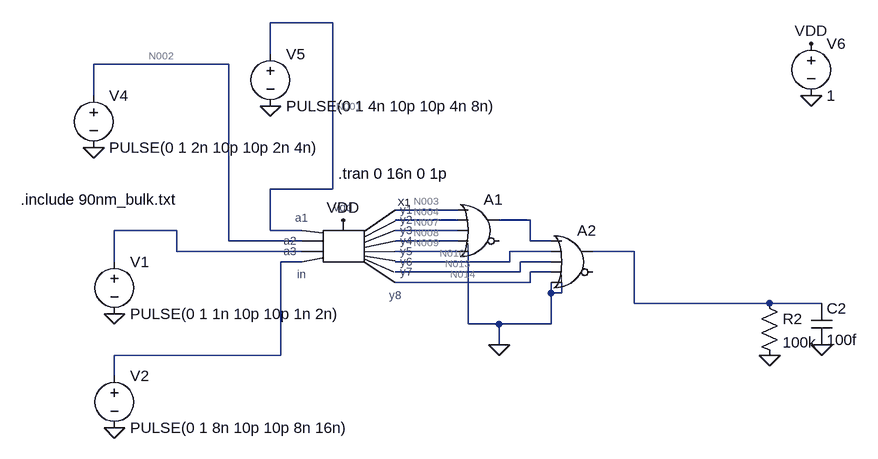
[diagram p0: schematic 2_exp1.asc]
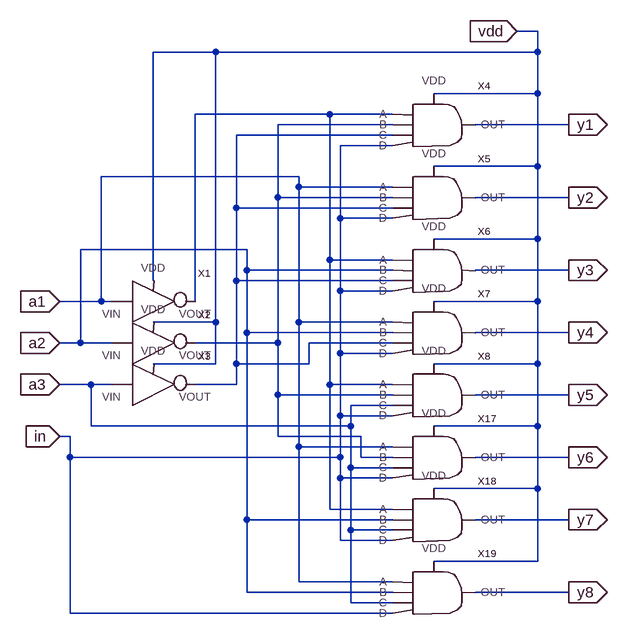
[diagram p1: sub-circuit decoder.asc]
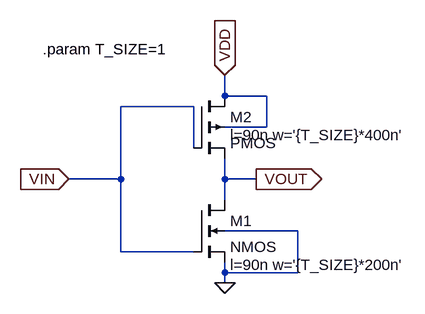
[diagram p2: sub-circuit inverter.asc]
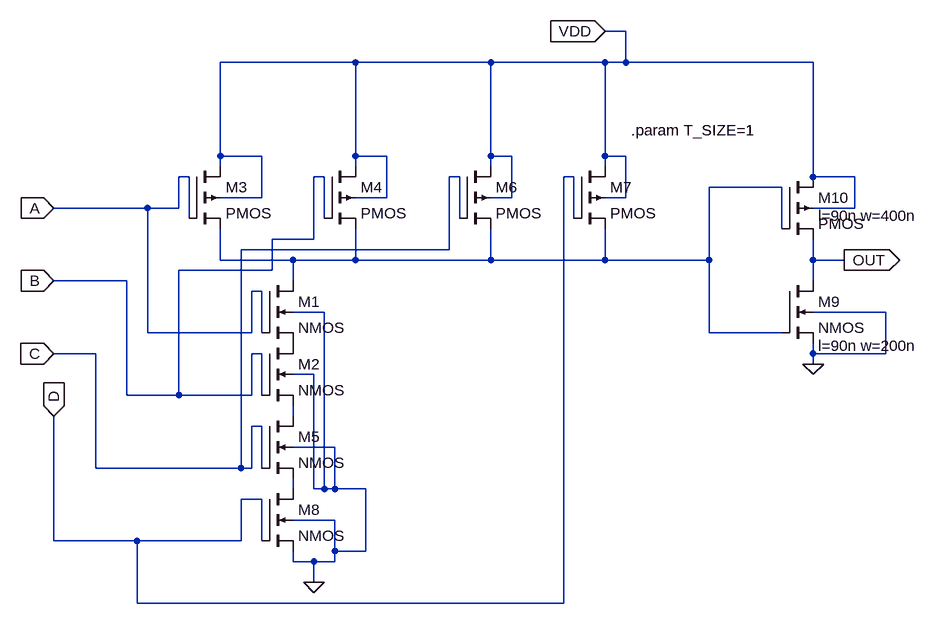
[diagram p3: sub-circuit and4.asc]
2_exp1.asc, the LTspice schematic file:
Version 4
SHEET 1 972 680
WIRE 160 -288 64 -288
WIRE 64 -240 64 -288
WIRE 0 -224 -208 -224
WIRE -208 -176 -208 -224
WIRE 160 -32 160 -288
WIRE 160 -32 64 -32
WIRE 352 0 256 0
WIRE 352 16 256 16
WIRE 464 16 416 16
WIRE -80 32 -176 32
WIRE 64 32 64 -32
WIRE 112 32 64 32
WIRE 352 32 256 32
WIRE 0 48 0 -224
WIRE 112 48 0 48
WIRE 352 48 256 48
WIRE 464 48 464 16
WIRE 496 48 464 48
WIRE -80 64 -80 32
WIRE 112 64 -80 64
WIRE 352 64 256 64
WIRE 496 64 432 64
WIRE 624 64 560 64
WIRE -176 80 -176 32
WIRE 112 80 80 80
WIRE 432 80 432 64
WIRE 432 80 256 80
WIRE 496 80 448 80
WIRE 448 96 448 80
WIRE 448 96 256 96
WIRE 496 96 464 96
WIRE 464 112 464 96
WIRE 464 112 256 112
WIRE 496 128 496 112
WIRE 512 128 512 112
WIRE 512 128 496 128
WIRE 624 144 624 64
WIRE 832 144 624 144
WIRE 912 144 832 144
WIRE 368 176 368 64
WIRE 416 176 368 176
WIRE 496 176 496 128
WIRE 496 176 416 176
WIRE 416 208 416 176
WIRE 80 224 80 80
WIRE 80 224 -176 224
WIRE -176 256 -176 224
FLAG -176 336 0
FLAG -176 160 0
FLAG -208 -96 0
FLAG 64 -160 0
FLAG 896 -176 0
FLAG 896 -256 VDD
FLAG 832 224 0
FLAG 912 208 0
FLAG 416 208 0
FLAG 176 16 VDD
SYMBOL voltage -176 64 R0
WINDOW 123 0 0 Left 2
WINDOW 39 0 0 Left 2
SYMATTR InstName V1
SYMATTR Value PULSE(0 1 1n 10p 10p 1n 2n)
SYMBOL voltage -176 240 R0
WINDOW 123 0 0 Left 2
WINDOW 39 0 0 Left 2
SYMATTR InstName V2
SYMATTR Value PULSE(0 1 8n 10p 10p 8n 16n)
SYMBOL decoder 176 64 R0
SYMATTR InstName X1
SYMBOL voltage -208 -192 R0
WINDOW 123 0 0 Left 2
WINDOW 39 0 0 Left 2
SYMATTR InstName V4
SYMATTR Value PULSE(0 1 2n 10p 10p 2n 4n)
SYMBOL voltage 64 -256 R0
WINDOW 123 0 0 Left 2
WINDOW 39 0 0 Left 2
SYMATTR InstName V5
SYMATTR Value PULSE(0 1 4n 10p 10p 4n 8n)
SYMBOL voltage 896 -272 R0
WINDOW 123 0 0 Left 2
WINDOW 39 0 0 Left 2
SYMATTR InstName V6
SYMATTR Value 1
SYMBOL res 816 128 R0
SYMATTR InstName R2
SYMATTR Value 100k
SYMBOL cap 896 144 R0
SYMATTR InstName C2
SYMATTR Value 100f
SYMBOL Digital\\or 384 -32 R0
SYMATTR InstName A1
SYMBOL Digital\\or 528 16 R0
SYMATTR InstName A2
TEXT -320 -16 Left 2 !.include 90nm_bulk.txt
TEXT 168 -56 Left 2 !.tran 0 16n 0 1p

decoder.asc, the sub-circuit schematic file:
Version 4
SHEET 1 1524 680
WIRE 736 -384 704 -384
WIRE 240 -352 144 -352
WIRE 736 -352 736 -384
WIRE 736 -352 240 -352
WIRE 736 -288 736 -352
WIRE 736 -288 576 -288
WIRE 416 -256 208 -256
WIRE 512 -256 416 -256
WIRE 512 -240 336 -240
WIRE 784 -240 640 -240
WIRE 512 -224 272 -224
WIRE 512 -208 432 -208
WIRE 736 -176 736 -288
WIRE 736 -176 576 -176
WIRE 368 -160 64 -160
WIRE 368 -144 368 -160
WIRE 512 -144 368 -144
WIRE 336 -128 336 -240
WIRE 512 -128 336 -128
WIRE 784 -128 640 -128
WIRE 272 -112 272 -224
WIRE 512 -112 272 -112
WIRE 432 -96 432 -208
WIRE 512 -96 432 -96
WIRE 736 -64 736 -176
WIRE 736 -64 576 -64
WIRE 288 -48 32 -48
WIRE 416 -32 416 -256
WIRE 512 -32 416 -32
WIRE 288 -16 288 -48
WIRE 512 -16 288 -16
WIRE 784 -16 640 -16
WIRE 144 0 144 -352
WIRE 272 0 272 -112
WIRE 512 0 272 0
WIRE 432 16 432 -96
WIRE 512 16 432 16
WIRE 64 32 64 -160
WIRE 64 32 0 32
WIRE 80 32 64 32
WIRE 208 32 208 -256
WIRE 736 32 736 -64
WIRE 736 32 576 32
WIRE 240 64 240 -352
WIRE 240 64 144 64
WIRE 368 64 368 -144
WIRE 512 64 368 64
WIRE 288 80 288 -16
WIRE 512 80 288 80
WIRE 784 80 640 80
WIRE 32 96 32 -48
WIRE 32 96 0 96
WIRE 80 96 32 96
WIRE 336 96 336 -128
WIRE 336 96 208 96
WIRE 512 96 384 96
WIRE 432 112 432 16
WIRE 512 112 432 112
WIRE 240 128 240 64
WIRE 240 128 144 128
WIRE 272 128 272 0
WIRE 384 128 384 96
WIRE 384 128 272 128
WIRE 736 128 736 32
WIRE 736 128 576 128
WIRE 48 160 0 160
WIRE 80 160 48 160
WIRE 272 160 272 128
WIRE 272 160 208 160
WIRE 416 160 416 -32
WIRE 512 160 416 160
WIRE 336 176 336 96
WIRE 512 176 336 176
WIRE 784 176 640 176
WIRE 512 192 448 192
WIRE 432 208 432 112
WIRE 512 208 432 208
WIRE 48 224 48 160
WIRE 448 224 448 192
WIRE 448 224 48 224
WIRE 736 224 736 128
WIRE 736 224 576 224
WIRE 16 240 0 240
WIRE 336 240 336 176
WIRE 464 240 336 240
WIRE 368 256 368 64
WIRE 512 256 368 256
WIRE 16 272 16 240
WIRE 432 272 432 208
WIRE 432 272 16 272
WIRE 464 272 464 240
WIRE 512 272 464 272
WIRE 784 272 640 272
WIRE 448 288 448 224
WIRE 512 288 448 288
WIRE 432 304 432 272
WIRE 512 304 432 304
WIRE 736 320 736 224
WIRE 736 320 576 320
WIRE 416 352 416 160
WIRE 512 352 416 352
WIRE 288 368 288 80
WIRE 512 368 288 368
WIRE 784 368 640 368
WIRE 448 384 448 288
WIRE 512 384 448 384
WIRE 432 400 432 304
WIRE 512 400 432 400
WIRE 736 432 736 320
WIRE 736 432 576 432
WIRE 368 464 368 256
WIRE 512 464 368 464
WIRE 288 480 288 368
WIRE 512 480 288 480
WIRE 784 480 640 480
WIRE 448 496 448 384
WIRE 512 496 448 496
WIRE 16 512 16 272
WIRE 512 512 16 512
FLAG 0 32 a1
IOPIN 0 32 In
FLAG 0 96 a2
IOPIN 0 96 In
FLAG 0 160 a3
IOPIN 0 160 In
FLAG 0 240 in
IOPIN 0 240 In
FLAG 704 -384 vdd
IOPIN 704 -384 In
FLAG 784 -240 y1
IOPIN 784 -240 Out
FLAG 784 -128 y2
IOPIN 784 -128 Out
FLAG 784 -16 y3
IOPIN 784 -16 Out
FLAG 784 80 y4
IOPIN 784 80 Out
FLAG 784 176 y5
IOPIN 784 176 Out
FLAG 784 272 y6
IOPIN 784 272 Out
FLAG 784 368 y7
IOPIN 784 368 Out
FLAG 784 480 y8
IOPIN 784 480 Out
SYMBOL inverter 144 32 R0
SYMATTR InstName X1
SYMBOL inverter 144 96 R0
SYMATTR InstName X2
SYMBOL inverter 144 160 R0
SYMATTR InstName X3
SYMBOL and4 592 -224 R0
SYMATTR InstName X4
SYMBOL and4 592 -112 R0
SYMATTR InstName X5
SYMBOL and4 592 0 R0
SYMATTR InstName X6
SYMBOL and4 592 96 R0
SYMATTR InstName X7
SYMBOL and4 592 192 R0
SYMATTR InstName X8
SYMBOL and4 592 288 R0
SYMATTR InstName X17
SYMBOL and4 592 384 R0
SYMATTR InstName X18
SYMBOL and4 592 496 R0
SYMATTR InstName X19

inverter.asc, the sub-circuit schematic file:
Version 4
SHEET 1 880 680
WIRE 176 -128 176 -160
WIRE 240 -128 176 -128
WIRE 128 -112 16 -112
WIRE 240 -80 240 -128
WIRE 240 -80 176 -80
WIRE 128 -48 128 -112
WIRE 16 0 16 -112
WIRE 16 0 -64 0
WIRE 176 0 176 -32
WIRE 224 0 176 0
WIRE 176 32 176 0
WIRE 288 80 176 80
WIRE 16 112 16 0
WIRE 128 112 16 112
WIRE 176 144 176 128
WIRE 288 144 288 80
WIRE 288 144 176 144
WIRE 176 160 176 144
FLAG 176 160 0
FLAG -64 0 VIN
IOPIN -64 0 In
FLAG 224 0 VOUT
IOPIN 224 0 Out
FLAG 176 -160 VDD
IOPIN 176 -160 In
SYMBOL nmos4 128 32 R0
WINDOW 123 56 100 Left 2
SYMATTR InstName M1
SYMATTR Value2 l=90n w='{T_SIZE}*200n'
SYMBOL pmos4 128 -128 R0
WINDOW 123 56 60 Left 2
SYMATTR InstName M2
SYMATTR Value2 l=90n w='{T_SIZE}*400n'
TEXT -104 -200 Left 2 !.param T_SIZE=1

and4.asc, the sub-circuit schematic file:
Version 4
SHEET 1 1276 740
WIRE 480 -256 448 -256
WIRE 64 -208 -144 -208
WIRE 272 -208 64 -208
WIRE 448 -208 272 -208
WIRE 480 -208 480 -256
WIRE 480 -208 448 -208
WIRE 768 -208 480 -208
WIRE -144 -64 -144 -208
WIRE -80 -64 -144 -64
WIRE 64 -64 64 -208
WIRE 112 -64 64 -64
WIRE 272 -64 272 -208
WIRE 304 -64 272 -64
WIRE 448 -64 448 -208
WIRE 480 -64 448 -64
WIRE -144 -48 -144 -64
WIRE 64 -48 64 -64
WIRE 272 -48 272 -64
WIRE 448 -48 448 -64
WIRE -192 -32 -208 -32
WIRE 16 -32 0 -32
WIRE 224 -32 208 -32
WIRE 400 -32 384 -32
WIRE 768 -32 768 -208
WIRE 832 -32 768 -32
WIRE 720 -16 608 -16
WIRE -80 0 -80 -64
WIRE -80 0 -144 0
WIRE 112 0 112 -64
WIRE 112 0 64 0
WIRE 304 0 304 -64
WIRE 304 0 272 0
WIRE 480 0 480 -64
WIRE 480 0 448 0
WIRE -256 16 -400 16
WIRE -208 16 -208 -32
WIRE -208 16 -256 16
WIRE 832 16 832 -32
WIRE 832 16 768 16
WIRE -192 32 -192 -32
WIRE 16 32 16 -32
WIRE 224 32 224 -32
WIRE 400 32 400 -32
WIRE 720 48 720 -16
WIRE 0 64 0 -32
WIRE 0 64 -64 64
WIRE 208 80 208 -32
WIRE 208 80 -112 80
WIRE -144 96 -144 48
WIRE -32 96 -144 96
WIRE 64 96 64 48
WIRE 64 96 -32 96
WIRE 272 96 272 48
WIRE 272 96 64 96
WIRE 448 96 448 48
WIRE 448 96 272 96
WIRE 608 96 608 -16
WIRE 608 96 448 96
WIRE 768 96 768 64
WIRE 816 96 768 96
WIRE -64 112 -64 64
WIRE -64 112 -208 112
WIRE -288 128 -400 128
WIRE -32 128 -32 96
WIRE 768 128 768 96
WIRE -80 144 -96 144
WIRE 16 176 -32 176
WIRE 880 176 768 176
WIRE -256 208 -256 16
WIRE -96 208 -96 144
WIRE -96 208 -256 208
WIRE -80 208 -80 144
WIRE 608 208 608 96
WIRE 720 208 608 208
WIRE -336 240 -400 240
WIRE -80 240 -96 240
WIRE 768 240 768 224
WIRE 880 240 880 176
WIRE 880 240 768 240
WIRE 768 256 768 240
WIRE 0 272 -32 272
WIRE -288 304 -288 128
WIRE -208 304 -208 112
WIRE -208 304 -288 304
WIRE -96 304 -96 240
WIRE -96 304 -208 304
WIRE -80 304 -80 240
WIRE -32 336 -32 320
WIRE -80 352 -96 352
WIRE 32 384 -32 384
WIRE -336 416 -336 240
WIRE -112 416 -112 80
WIRE -112 416 -336 416
WIRE -96 416 -96 352
WIRE -96 416 -112 416
WIRE -80 416 -80 352
WIRE -32 448 -32 432
WIRE 0 448 0 272
WIRE 16 448 16 176
WIRE 16 448 0 448
WIRE 32 448 32 384
WIRE 32 448 16 448
WIRE 80 448 32 448
WIRE -80 464 -112 464
WIRE 32 496 -32 496
WIRE -400 528 -400 336
WIRE -272 528 -400 528
WIRE -112 528 -112 464
WIRE -112 528 -272 528
WIRE -80 528 -80 464
WIRE 32 544 32 496
WIRE 80 544 80 448
WIRE 80 544 32 544
WIRE -32 560 -32 544
WIRE 0 560 -32 560
WIRE 32 560 32 544
WIRE 32 560 0 560
WIRE 0 592 0 560
WIRE -272 624 -272 528
WIRE 384 624 384 -32
WIRE 384 624 -272 624
FLAG -400 16 A
IOPIN -400 16 In
FLAG -400 128 B
IOPIN -400 128 In
FLAG -400 240 C
IOPIN -400 240 In
FLAG -400 336 D
IOPIN -400 336 In
FLAG 0 592 0
FLAG 768 256 0
FLAG 816 96 OUT
IOPIN 816 96 Out
FLAG 448 -256 VDD
IOPIN 448 -256 In
SYMBOL nmos4 -80 128 R0
SYMATTR InstName M1
SYMATTR Value2 l=90n w=200n
SYMBOL nmos4 -80 224 R0
SYMATTR InstName M2
SYMATTR Value2 l=90n w=200n
SYMBOL pmos4 -192 -48 R0
SYMATTR InstName M3
SYMATTR Value2 l=90n w=400n
SYMBOL pmos4 16 -48 R0
SYMATTR InstName M4
SYMATTR Value2 l=90n w=400n
SYMBOL nmos4 -80 336 R0
SYMATTR InstName M5
SYMATTR Value2 l=90n w=200n
SYMBOL pmos4 224 -48 R0
SYMATTR InstName M6
SYMATTR Value2 l=90n w=400n
SYMBOL pmos4 400 -48 R0
SYMATTR InstName M7
SYMATTR Value2 l=90n w=400n
SYMBOL nmos4 -80 448 R0
SYMATTR InstName M8
SYMATTR Value2 l=90n w=200n
SYMBOL nmos4 720 128 R0
WINDOW 123 56 100 Left 2
SYMATTR Value2 l=90n w=200n
SYMATTR InstName M9
SYMBOL pmos4 720 -32 R0
WINDOW 123 56 60 Left 2
SYMATTR Value2 l=90n w=400n
SYMATTR InstName M10
TEXT 488 -104 Left 2 !.param T_SIZE=1

The netlist it stands for:
* 2_exp1.asc
V1 N006 0 PULSE(0 1 1n 10p 10p 1n 2n)
V2 N012 0 PULSE(0 1 8n 10p 10p 8n 16n)
XX1 N001 N002 N006 N012 N003 N004 N007 N008 N009 N010 N013 N014 VDD decoder
V4 N002 0 PULSE(0 1 2n 10p 10p 2n 4n)
V5 N001 0 PULSE(0 1 4n 10p 10p 4n 8n)
V6 VDD 0 1
R2 N011 0 100k
C2 N011 0 100f
A1 N003 N004 N007 N008 N009 0 N005 0 OR
A2 N005 N010 N013 N014 0 0 N011 0 OR

* block symbol definitions
.subckt decoder a1 a2 a3 in y1 y2 y3 y4 y5 y6 y7 y8 vdd
XX1 a1 vdd N001 inverter
XX2 a2 vdd N002 inverter
XX3 a3 vdd N003 inverter
XX4 N001 N002 N003 in y1 vdd and4
XX5 a1 N002 N003 in y2 vdd and4
XX6 N001 a2 N003 in y3 vdd and4
XX7 a1 a2 N003 in y4 vdd and4
XX8 N001 N002 a3 in y5 vdd and4
XX17 a1 N002 a3 in y6 vdd and4
XX18 N001 a2 a3 in y7 vdd and4
XX19 a1 a2 a3 in y8 vdd and4
.ends decoder

.subckt inverter VIN VDD VOUT
M1 VOUT VIN 0 0 NMOS l=90n w='{T_SIZE}*200n'
M2 VDD VIN VOUT VDD PMOS l=90n w='{T_SIZE}*400n'
.param T_SIZE=1
.ends inverter

.subckt and4 A B C D OUT VDD
M1 N001 A P001 0 NMOS l=90n w=200n
M2 P001 B N002 0 NMOS l=90n w=200n
M3 VDD A N001 VDD PMOS l=90n w=400n
M4 VDD B N001 VDD PMOS l=90n w=400n
M5 N002 C N003 0 NMOS l=90n w=200n
M6 VDD C N001 VDD PMOS l=90n w=400n
M7 VDD D N001 VDD PMOS l=90n w=400n
M8 N003 D 0 0 NMOS l=90n w=200n
M9 OUT N001 0 0 NMOS l=90n w=200n
M10 VDD N001 OUT VDD PMOS l=90n w=400n
.param T_SIZE=1
.ends and4

.model NMOS NMOS
.model PMOS PMOS
.lib standard.mos
.include 90nm_bulk.txt
.tran 0 16n 0 1p
.backanno
.end

* Results of the author's LTspice run, read from the files saved beside the schematic
* Operating Point, zero values left out:
*   V(vdd) = 1 V
*   V(n003) = 11.34 µV
*   V(n004) = 11.34 µV
*   V(n007) = 11.34 µV
*   V(n008) = 11.34 µV
*   V(n009) = 11.34 µV
*   V(n010) = 11.34 µV
*   V(n013) = 11.34 µV
*   V(n014) = 11.34 µV
*   I(V6) = -85.33 nA
*   I(V5) = 654.7 pA
*   I(V4) = 238.1 pA
*   I(V2) = 46.53 pA
*   I(V1) = 178.8 pA
*   Ix(x1:A1) = -654.7 pA
*   Ix(x1:A2) = -238.1 pA
*   Ix(x1:A3) = -178.8 pA
*   Ix(x1:IN) = -46.53 pA
*   Ix(x1:VDD) = 85.33 nA
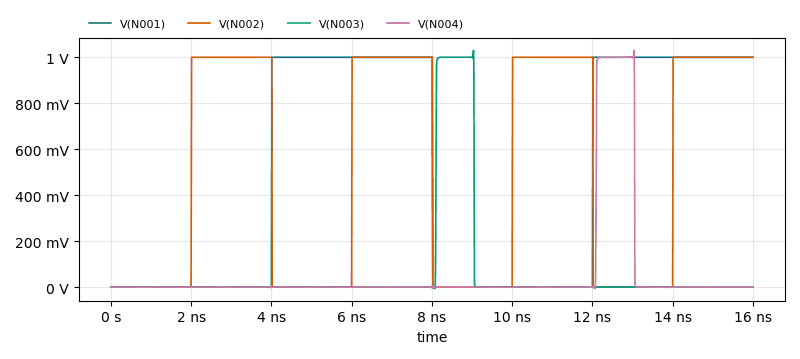
[diagram p4: Transient Analysis of 2_exp1.asc, plotted from the saved traces]
* Transient Analysis, 1 run:
*   V(N001): min 0 V, max 1 V, average 500.3 mV, rms 707.1 mV, last 1 V
*   V(N002): min 0 V, max 1 V, average 501.6 mV, rms 707.7 mV, last 1 V
*   V(N003): min -7.545 mV, max 1.03 V, average 59.48 mV, rms 243 mV, last 11.34 µV
*   V(N004): min -7.265 mV, max 1.03 V, average 59.96 mV, rms 244 mV, last 11.35 µV